# EAGLE design timer_controller (EAGLE 9.5.1)
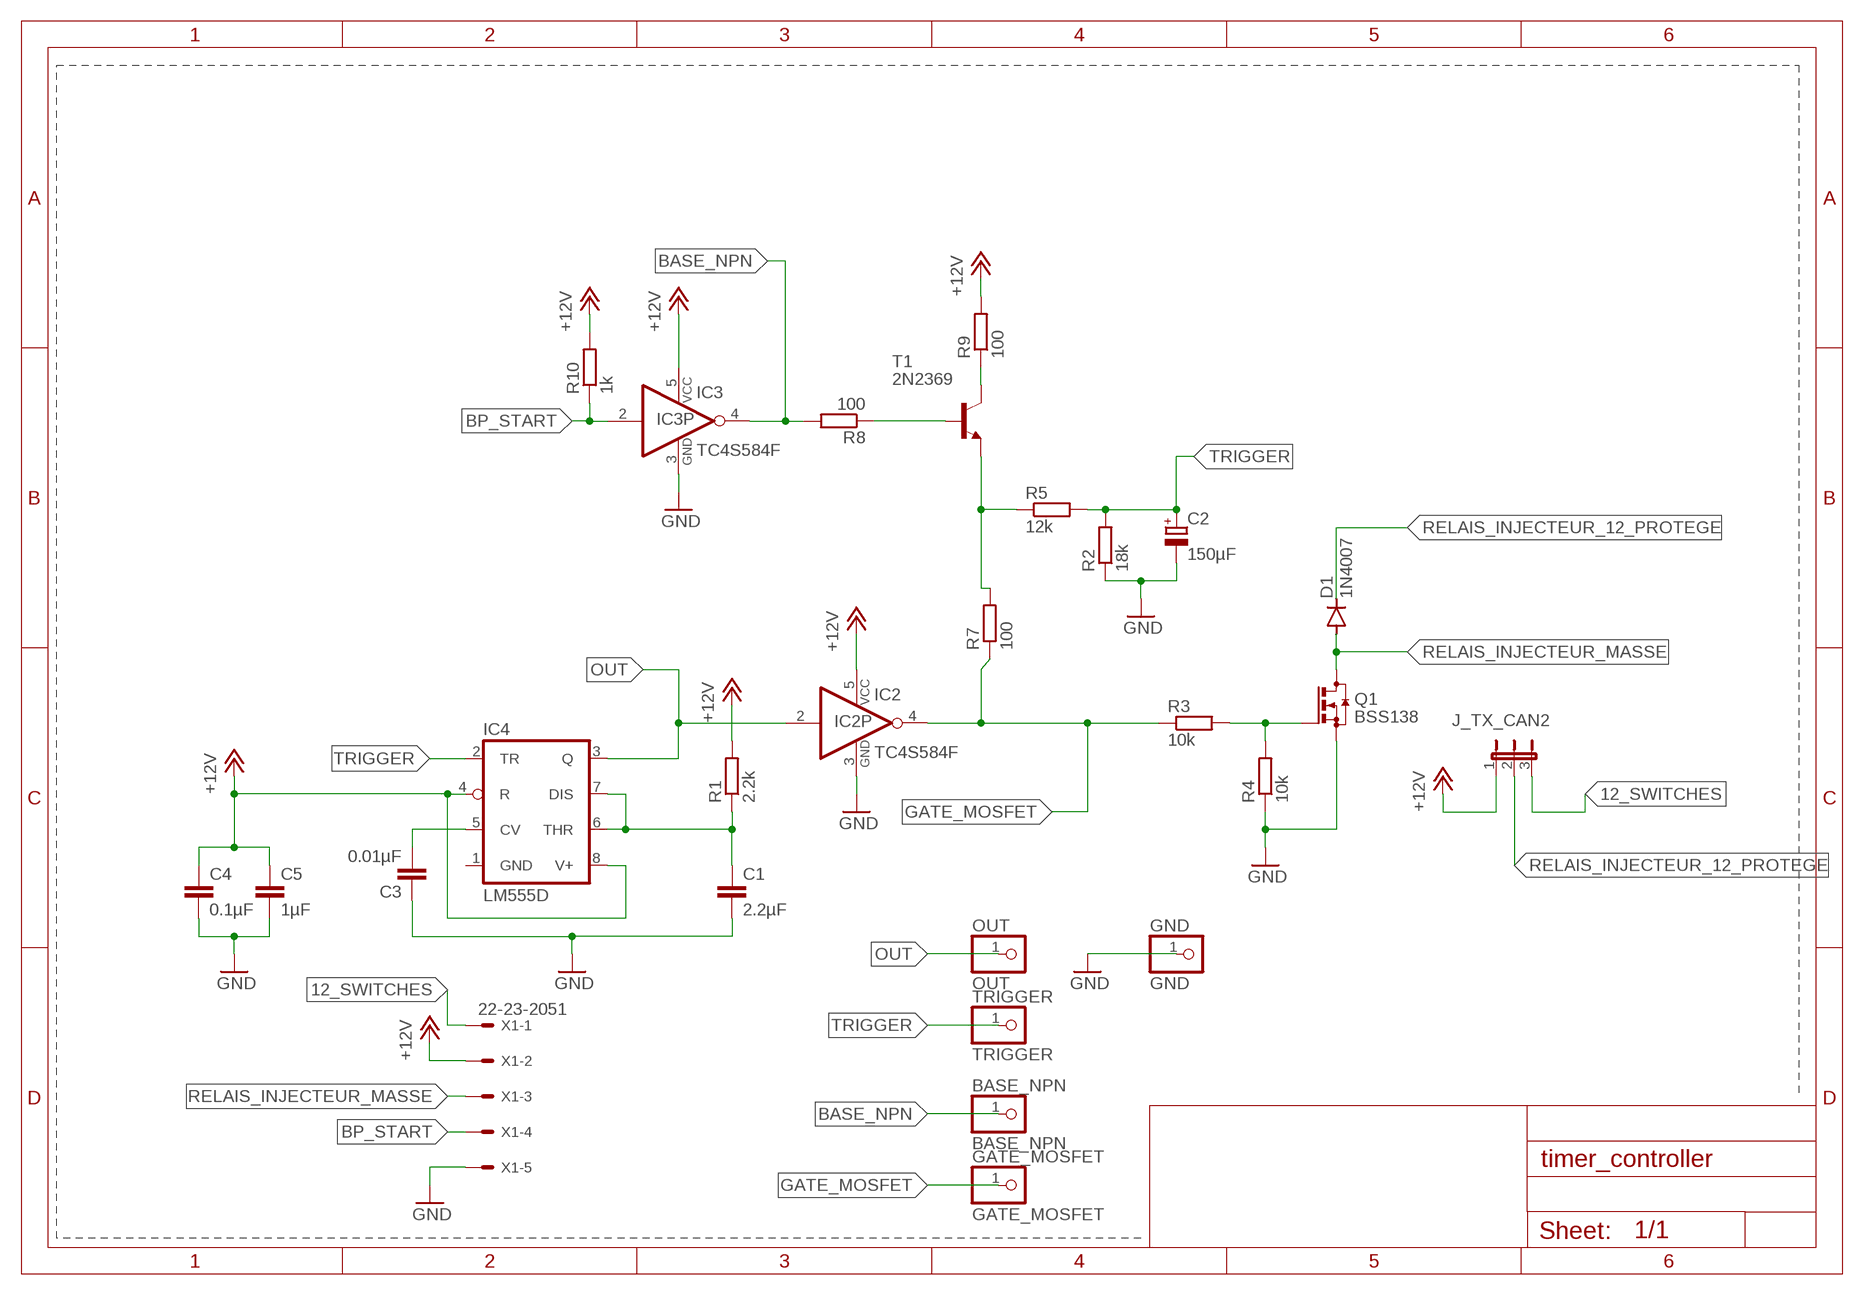
[diagram p0: schematic, sheet 1]

## Parts
BASE_NPN  BASE_NPN  PINHD-1X1  [1X01]
C1  2.2µF  C-EUC0805  [C0805]
C2  150µF  CPOL-EU153CLV-0605  [153CLV-0605]
C3  0.01µF  C-EUC0805  [C0805]
C4  0.1µF  C-EUC0805  [C0805]
C5  1µF  C-EUC0805  [C0805]
D1  1N4007  1N4004  [DO41-10]
GATE_MOSFET  GATE_MOSFET  PINHD-1X1  [1X01]
GND  GND  PINHD-1X1  [1X01]
IC2  TC4S584F  74AHC1G04DBV  [SOT23-5]
IC3  TC4S584F  74AHC1G04DBV  [SOT23-5]
IC4  LM555D  [SO08]
J_TX_CAN2  JP2E  [JP2]
OUT  OUT  PINHD-1X1  [1X01]
Q1  BSS138  BSS123  [SOT23]
R1  2.2k  R-EU_R0805  [R0805]
R2  18k  R-EU_R0805  [R0805]
R3  10k  R-EU_R0805  [R0805]
R4  10k  R-EU_R0805  [R0805]
R5  12k  R-EU_R0805  [R0805]
R7  100  R-EU_R0805  [R0805]
R8  100  R-EU_R0805  [R0805]
R9  100  R-EU_R0805  [R0805]
R10  1k  R-EU_R0805  [R0805]
T1  2N2369  BC846  [SOT23]
TRIGGER  TRIGGER  PINHD-1X1  [1X01]
X1  22-23-2051  [22-23-2051]

## Nets
12_SWITCHES: J_TX_CAN2.3 X1.1
+12V: C4.1 C5.1 IC2.5(VCC) IC3.5(VCC) IC4.4(R) IC4.8(V+) J_TX_CAN2.1 R1.2 R9.2 R10.2 X1.2
BASE_NPN: BASE_NPN.1 IC3.4(O) R8.2
BP_START: IC3.2(I) R10.1 X1.4
GATE_MOSFET: GATE_MOSFET.1 IC2.4(O) R3.1 R7.1
GND: C1.2 C2.- C3.1 C4.2 C5.2 GND.1 IC2.3(GND) IC3.3(GND) Q1.2(S) R2.1 R4.1 X1.5
N$1: Q1.1(G) R3.2 R4.2
N$2: R9.1 T1.3(C)
N$9: C3.2 IC4.5(CV)
N$17: C1.1 IC4.6(THR) IC4.7(DIS) R1.1
N$26: R5.1 R7.2 T1.2(E)
N$27: R8.1 T1.1(B)
OUT: IC2.2(I) IC4.3(Q) OUT.1
RELAIS_INJECTEUR: X1.3
RELAIS_INJECTEUR_12_PROTEGE: D1.C J_TX_CAN2.2
RELAIS_INJECTEUR_MASSE: D1.A Q1.3(D)
TRIGGER: C2.+ IC4.2(TR) R2.2 R5.2 TRIGGER.1

## Power pins joined to a net without a drawn wire
GND: IC4.1(GND)

## Library data of the parts
BASE_NPN GATE_MOSFET GND OUT TRIGGER = pinhead:PINHD-1X1: PIN HEADER
C1 C3-C5 = rcl:C-EU: CAPACITOR, European symbol; SPICEPREFIX: C
C2 = rcl:CPOL-EU: POLARIZED CAPACITOR, European symbol; SPICEPREFIX: C
D1 = diode:1N4004: DIODE general purpose rectifier, 1 A
IC2 IC3 = 74xx-little-us:74*1G04: INVERTER Gate
IC4 = linear:*555: TIMER
J_TX_CAN2 = jumper:JP2E: JUMPER
Q1 = transistor-small-signal:BSS123: N-CHANNEL MOS FET
R1-R5 R7-R10 = rcl:R-EU_: RESISTOR, European symbol; SPICEPREFIX: R
T1 = transistor-neu-to92:BC846: NPN TRANSISTOR
X1 = con-molex:22-23-2051: .100" (2.54mm) Center Header - 5 Pin; MF: MOLEX; MPN: 22-23-2051; OC_FARNELL: 1462952; OC_NEWARK: 38C9178

## Net classes
0 default: width 0.61 mm

## Board
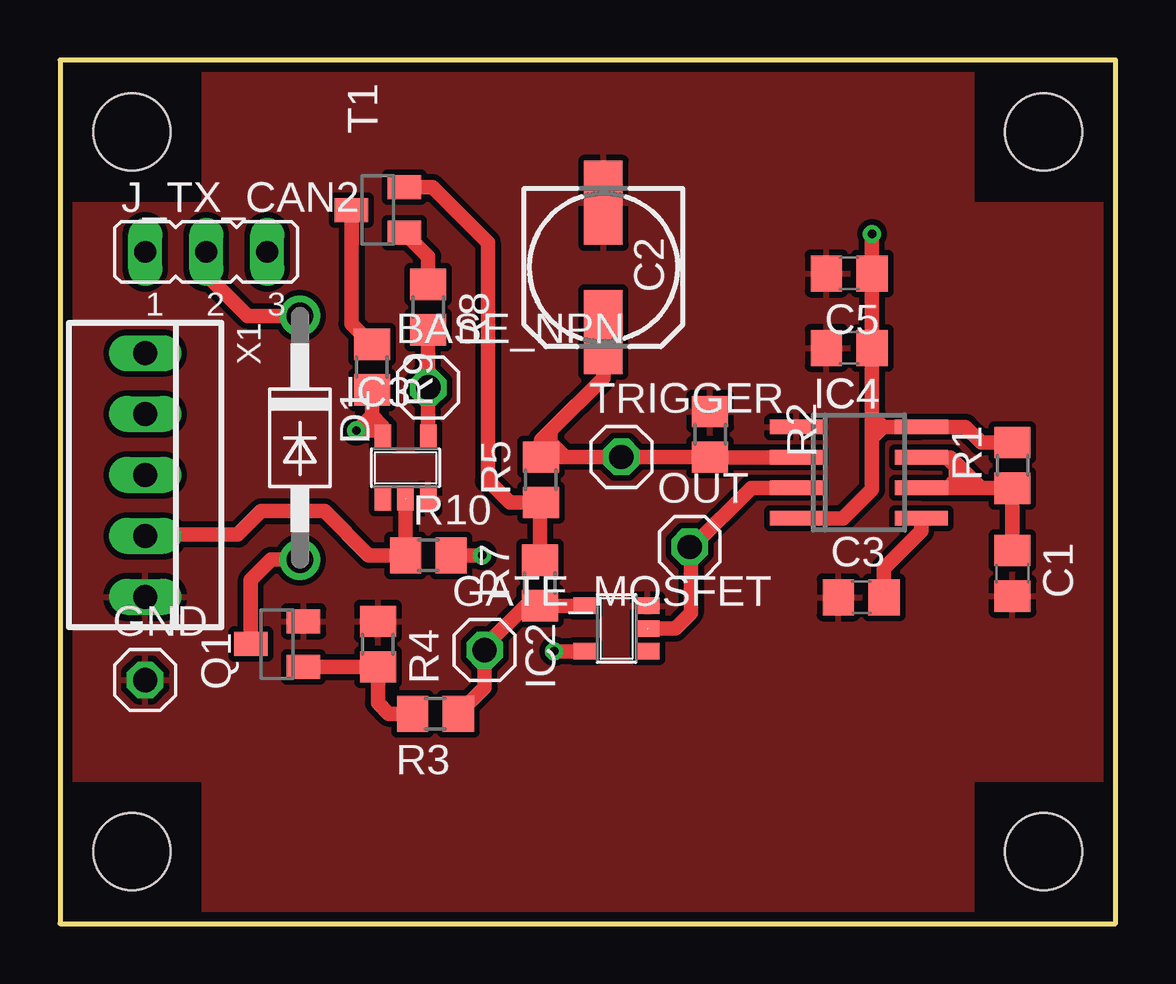
[diagram p1: board, top side]
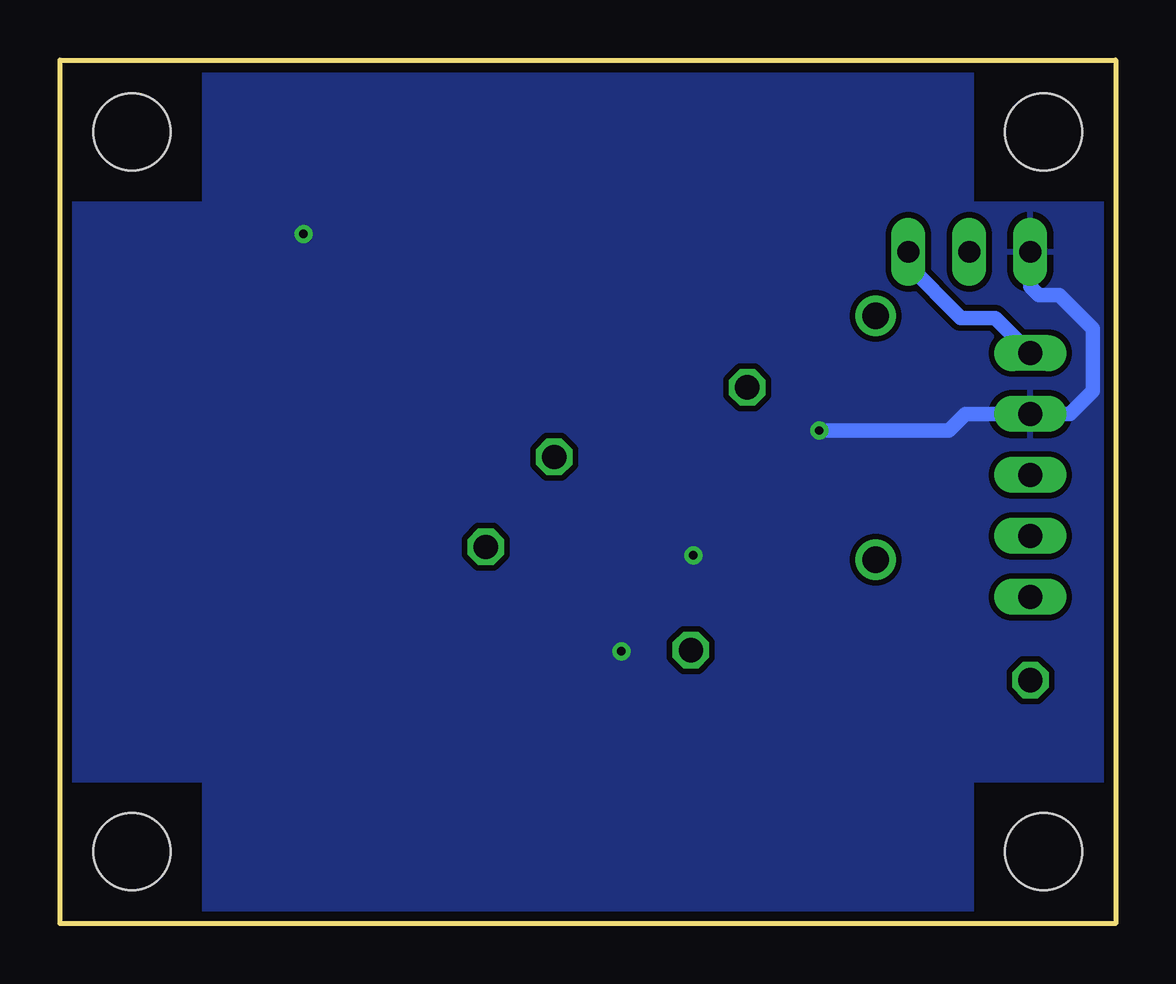
[diagram p2: board, bottom side, seen from below]

Size 44 x 36 mm. Coordinates in mm from the lower left corner, seen from the top.
Outline: 0,0 44,0 44,36 0,36 0,0
Copper layers (1*16): Top 0.035mm / dielectric 0.11mm / Bottom 0.035mm
Design rules "MCS-standard *": minimum track width 0.24mm, minimum drill 0.3mm, track to track 0.24mm, track to pad 0.24mm, pad to pad 0.24mm, via to via 0.24mm, smd to smd 0.24mm, copper to edge 0.4mm, drill to drill 0.3mm, minimum pad ring 10mil, minimum via ring 0.2mm, stop-mask expansion 0.05mm, vias tented up to drill 0.4mm, thermal gap 10mil
Holes 3.2 mm at 3,33 3,3 41,3 41,33
tKeepout: area 38.2,30.2 to 43.8,35.8; area 0.2,30.2 to 5.8,35.8; area 0.2,0.2 to 5.8,5.8; area 38.2,0.2 to 43.8,5.8

### Footprints (pad centres in the part's own frame; a part is rotated, then mirrored left to right if it is on the bottom)
1X01 = drill 1.016 octagon: 1 0,0
C0805 = smd 1.3 x 1.5: 1 -0.95,0; 2 0.95,0
153CLV-0605 = smd 3.5 x 1.6: + 2.7,0; - -2.7,0
DO41-10 = drill 1.118: A 5.08,0; C -5.08,0
SOT23-5 = smd 0.69 x 0.99: 1 -0.95,-1.29; 2 0,-1.29; 3 0.95,-1.29; 4 0.95,1.3; 5 -0.95,1.3
SO08 = smd 0.6 x 2.2: 1 -1.905,-2.6; 2 -0.635,-2.6; 3 0.635,-2.6; 4 1.905,-2.6; 5 1.905,2.6; 6 0.635,2.6; 7 -0.635,2.6; 8 -1.905,2.6
JP2 = drill 0.914 long: 1 -2.54,0; 2 0,0; 3 2.54,0
SOT23 = smd 1 x 1.4: 1 -0.95,-1.1; 2 0.95,-1.1; 3 0,1.1
R0805 = smd 1.3 x 1.5: 1 -0.95,0; 2 0.95,0
22-23-2051 = drill 1 long: 1 -5.08,0; 2 -2.54,0; 3 0,0; 4 2.54,0; 5 5.08,0

### Placement (x,y rotation side)
BASE_NPN  15.35,22.35 0 top
C1  39.7,14.6 270 top
C2  22.65,27.35 270 top
C3  33.4,13.6 0 top
C4  32.9,24 180 top
C5  32.9,27.1 180 top
D1  10,20.25 270 top
GATE_MOSFET  17.7,11.4 0 top
GND  3.55,10.15 0 top
IC2  23.2,12.3 90 top
IC3  14.4,19 0 top
IC4  33.3,18.8 270 top
J_TX_CAN2  6.1,28 0 top
OUT  26.25,15.7 0 top
Q1  9.05,11.65 90 top
R1  39.7,19.1 90 top
R2  27.1,20.4 270 top
R3  15.65,8.75 180 top
R4  13.25,11.65 270 top
R5  20.05,18.5 90 top
R7  20,14.2 90 top
R8  15.35,25.7 270 top
R9  13,23.2 270 top
R10  15.35,15.35 0 top
T1  13.25,29.75 90 top
TRIGGER  23.4,19.45 0 top
X1  3.55,18.7 270 top

### Tracks (layer width: path | path; a pad name or v marks a point on that pad's centre or on a via)
12_SWITCHES
  Bottom 0.61: X1.1 5.02,25.25 6.45,25.25 8.64,27.44 J_TX_CAN2.3
+12V  (via drill 0.35)
  Top 0.61: IC2.5 v20.6,11.35 | v33.85,28.75 C5.1 C4.1 33.85,21.15 | R1.2 38.4,20.05 37.74,20.7 IC4.8 34.3,20.7 | 33.85,21.15 34.3,20.7 | R9.2 13,21.17 | 12.38,20.55 13,21.17 | v17.6,15.35 R10.2 | v12.35,20.55 13.2,20.55 IC3.5 13.45,20.72 13,21.17 | IC4.4 32.65,16.89 33.85,18.1 33.85,21.15 | 33.9,20.3 34.3,20.7
  Bottom 0.61: v12.35,20.55 6.95,20.55 6.26,21.24 X1.2 1.9,21.25 0.95,22.2 0.95,24.8 2.35,26.2 3.19,26.2 3.56,26.56 J_TX_CAN2.1
  pour Bottom (isolate 0.2): 6,36 38,36 38,30 44,30 44,6 38,6 38,0 6,0 6,6 0,6 0,30 6,30
BASE_NPN
  Top 0.61: IC3.4 BASE_NPN.1 R8.2
BP_START
  Top 0.61: IC3.2 R10.1 12.87,15.34 11.02,17.19 8.39,17.19 7.41,16.21 3.6,16.21 X1.4
GATE_MOSFET
  Top 0.61: R3.1 17.7,9.85 GATE_MOSFET.1 17.7,11.55 19.4,13.25 R7.1 IC2.4
GND
  pour Top: 0,30 6,30 6,36 38,36 38,30 44,30 44,6 38,6 38,0 6,0 6,6 0,6
N$1
  Top 0.61: Q1.1 R4.2 13.25,9.2 13.7,8.75 R3.2
N$2
  Top 0.61: T1.3 12.15,25 R9.1
N$9
  Top 0.61: IC4.5 35.9,16.36 34.35,14.81 C3.2
N$17
  Top 0.61: IC4.6 37,18.16 | 37,18.16 37.7,18.16 | 37.7,18.16 38.3,18.16 | 38.3,18.16 39.69,18.16 R1.1 | 36.19,19.43 IC4.7 | IC4.7 37.12,19.43 37.35,19.2 | 37.7,18.16 37.7,18.7 | 37.7,18.7 37.7,18.85 | 37.35,19.2 37.7,18.85 | 37.7,18.85 38.3,18.25 38.3,18.16 | IC4.7 36.97,19.43 37.7,18.7 | 37.35,19.2 37.35,18.52 37,18.16 | R1.1 39.8,18.05 | R1.1 C1.1
N$26
  Top 0.61: T1.2 15.53,30.7 17.84,28.39 17.84,18.47 18.76,17.55 R5.1 20.03,17.57 20,17.57 R7.2
N$27
  Top 0.61: T1.1 15.35,27.8 R8.1
OUT
  Top 0.61: IC4.3 28.82,18.16 26.35,15.7 OUT.1 26.3,15.65 26.3,12.95 25.65,12.3 IC2.2
RELAIS_INJECTEUR_12_PROTEGE
  Top 0.61: J_TX_CAN2.2 6.1,27.05 7.82,25.33 D1.C
RELAIS_INJECTEUR_MASSE
  Top 0.61: D1.A 8.8,15.17 7.95,14.32 Q1.3
TRIGGER
  Top 0.61: IC4.2 27.11,19.43 R2.2 TRIGGER.1 21.05,19.45 | 21.05,19.45 R5.2 20.05,20.15 20.45,20.55 | C2.+ 22.65,22.75 20.45,20.55 | 21.05,19.45 20.45,20.05 20.45,20.55

### Text on the board
tValues: Timer / INVICTUS
tStop: S1 | S2 | FSG 2019 BSPD V0.2